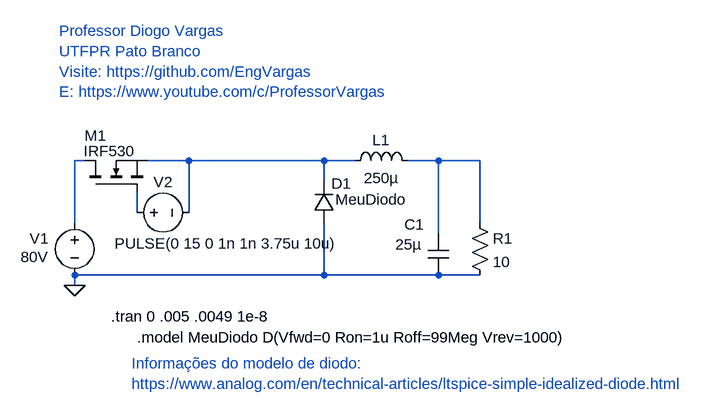
[diagram p0: schematic Conv-A03-Buck_CCM_(LTspice_nmos).asc]
Conv-A03-Buck_CCM_(LTspice_nmos).asc, the LTspice schematic file:
Version 4
SHEET 1 1304 680
WIRE 112 -64 96 -64
WIRE 272 -64 208 -64
WIRE 480 -64 272 -64
WIRE 528 -64 480 -64
WIRE 656 -64 608 -64
WIRE 720 -64 656 -64
WIRE 480 -32 480 -64
WIRE 192 16 192 -16
WIRE 272 16 272 -64
WIRE 96 32 96 -64
WIRE 720 32 720 -64
WIRE 656 48 656 -64
WIRE 480 112 480 32
WIRE 480 112 96 112
WIRE 656 112 480 112
WIRE 720 112 656 112
WIRE 96 128 96 112
FLAG 96 128 0
SYMBOL voltage 96 16 R0
WINDOW 3 -83 68 Left 2
WINDOW 0 -69 40 Left 2
WINDOW 123 0 0 Left 0
WINDOW 39 0 0 Left 0
SYMATTR Value 80V
SYMATTR InstName V1
SYMBOL voltage 176 16 R270
WINDOW 0 32 56 VTop 2
WINDOW 3 -32 154 VBottom 2
WINDOW 123 0 0 Left 2
WINDOW 39 0 0 Left 2
SYMATTR InstName V2
SYMATTR Value PULSE(0 15 0 1n 1n 3.75u 10u)
SYMBOL nmos 112 -16 R270
WINDOW 0 87 -1 VRight 2
WINDOW 3 63 -2 VRight 2
SYMATTR InstName M1
SYMATTR Value IRF530
SYMBOL ind 512 -48 R270
WINDOW 0 32 56 VTop 2
WINDOW 3 5 56 VBottom 2
SYMATTR InstName L1
SYMATTR Value 250µ
SYMBOL cap 640 48 R0
WINDOW 0 -36 -14 Left 2
WINDOW 3 -50 17 Left 2
SYMATTR InstName C1
SYMATTR Value 25µ
SYMBOL res 704 16 R0
SYMATTR InstName R1
SYMATTR Value 10
SYMBOL diode 496 32 R180
WINDOW 0 -26 61 Left 2
WINDOW 3 -112 36 Left 2
SYMATTR InstName D1
SYMATTR Value MeuDiodo
TEXT 152 176 Left 2 !.tran 0 .005 .0049 1e-8
TEXT 192 208 Left 2 !.model MeuDiodo D(Vfwd=0 Ron=1u Roff=99Meg Vrev=1000)
TEXT 184 248 Left 2 ;Informações do modelo de diodo:\nhttps://www.analog.com/en/technical-articles/ltspice-simple-idealized-diode.html
TEXT 72 -264 Left 2 ;Professor Diogo Vargas\nUTFPR Pato Branco\nVisite: https://github.com/EngVargas\nE: https://www.youtube.com/c/ProfessorVargas

The netlist it stands for:
* Conv-A03-Buck_CCM_(LTspice_nmos).asc
V1 N001 0 80V
V2 N004 N002 PULSE(0 15 0 1n 1n 3.75u 10u)
M1 N001 N004 N002 N002 IRF530
L1 N002 N003 250µ
C1 N003 0 25µ
R1 N003 0 10
D1 0 N002 MeuDiodo
.model D D
.lib standard.dio
.model NMOS NMOS
.model PMOS PMOS
.lib standard.mos
.tran 0 .005 .0049 1e-8
.model MeuDiodo D(Vfwd=0 Ron=1u Roff=99Meg Vrev=1000)
* Informações do modelo de diodo:
* https://www.analog.com/en/technical-articles/ltspice-simple-idealized-diode.html
* Professor Diogo Vargas
* UTFPR Pato Branco
* Visite: https://github.com/EngVargas
* E: https://www.youtube.com/c/ProfessorVargas
.backanno
.end